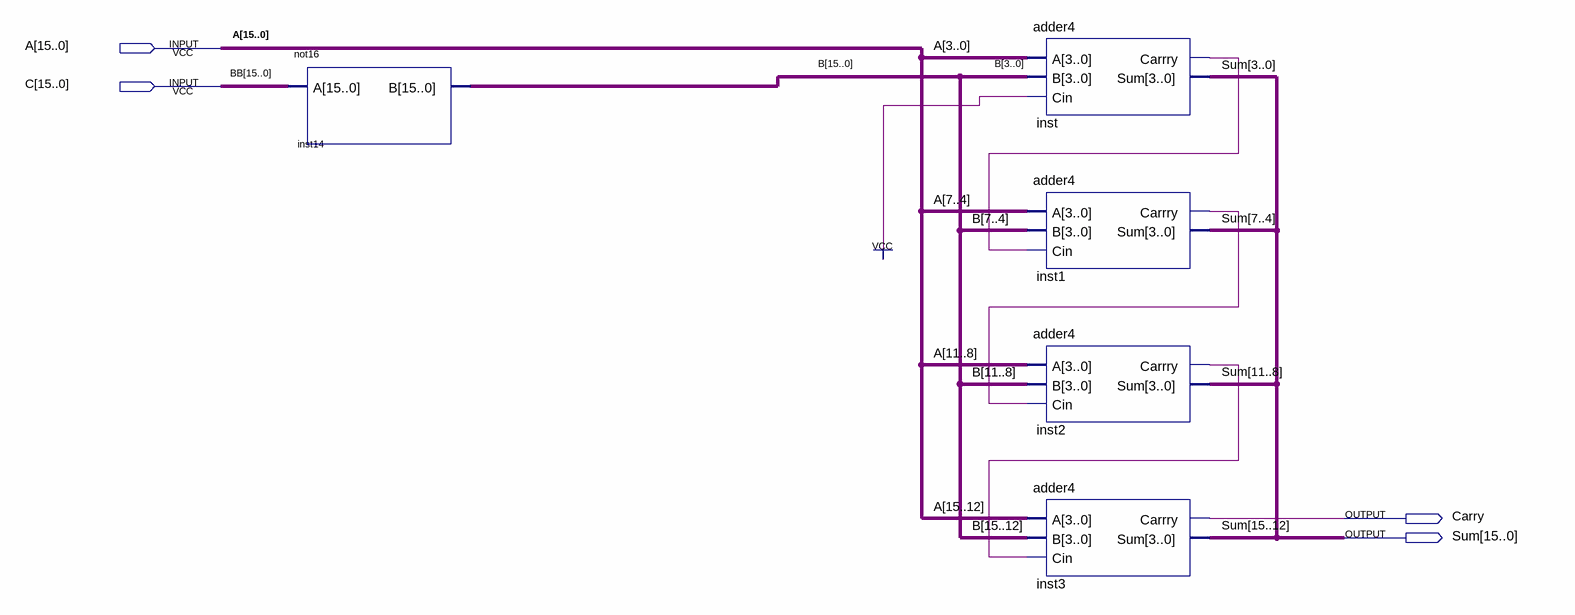
[diagram p0: schematic sheet]
// Quartus schematic ex1ALU_SUB.bdf as structural Verilog: 5 symbols, 4 pins
module ex1ALU_SUB (
  input  [15:0] A,
  input  [15:0] C,
  output Carry,
  output [15:0] Sum
);

  wire inst1_carrry, inst2_carrry, inst_carrry;
  wire [15:0] B;

  not16 inst14 (.A(C), .B(B));
  adder4 inst (.A(A[3:0]), .B(B[3:0]), .Cin(1'b1), .Carrry(inst_carrry), .Sum(Sum[3:0]));
  adder4 inst1 (.A(A[7:4]), .B(B[7:4]), .Cin(inst_carrry), .Carrry(inst1_carrry), .Sum(Sum[7:4]));
  adder4 inst2 (.A(A[11:8]), .B(B[11:8]), .Cin(inst1_carrry), .Carrry(inst2_carrry), .Sum(Sum[11:8]));
  adder4 inst3 (.A(A[15:12]), .B(B[15:12]), .Cin(inst2_carrry), .Carrry(Carry), .Sum(Sum[15:12]));

  // Other names for the same wires on the sheet: BB[15:0] = C
endmodule
